# EAGLE schematic untitled (EAGLE 8.4.3)
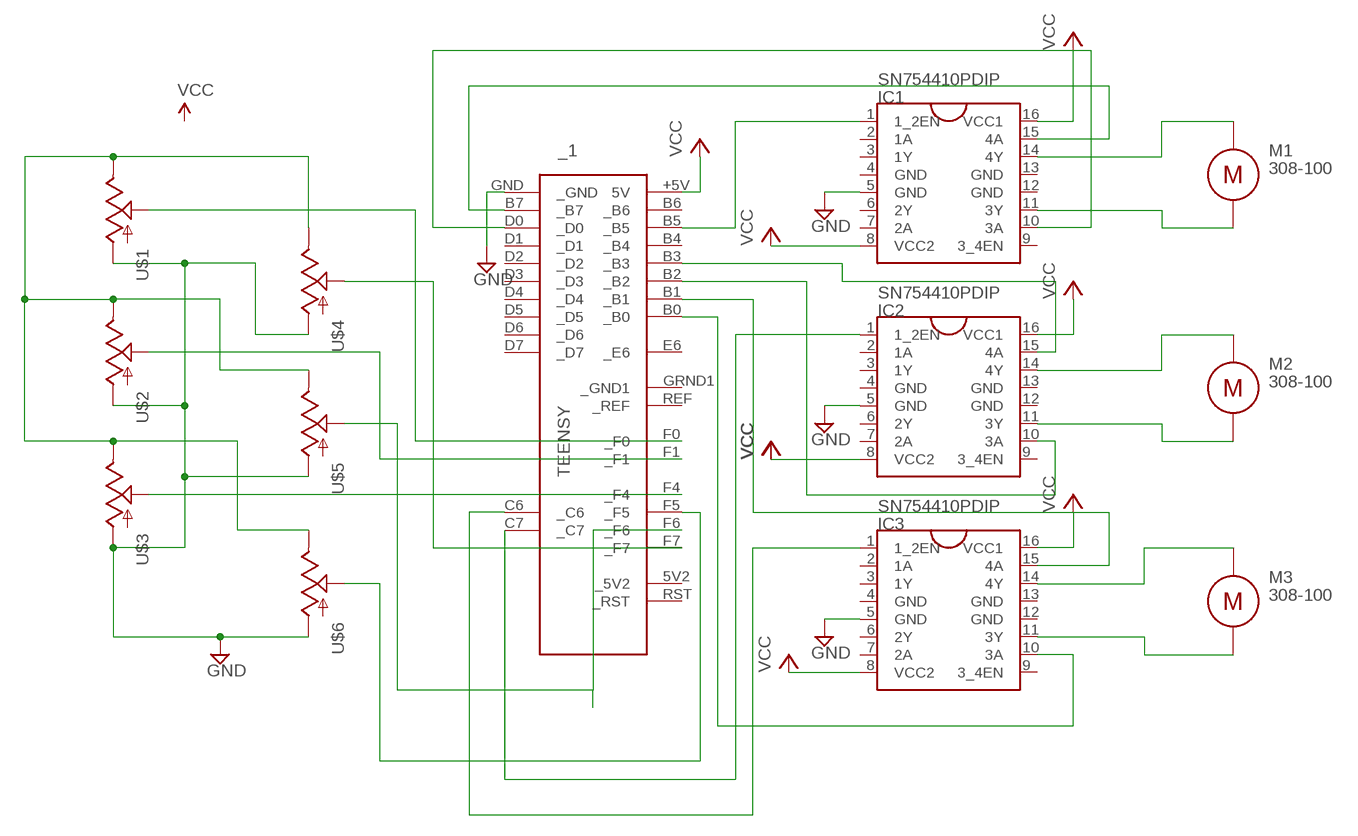
[diagram p0: schematic, sheet 1]

## Parts
_1  TEENSY  [TEENSY]
IC1  SN754410PDIP  [DIL16]
IC2  SN754410PDIP  [DIL16]
IC3  SN754410PDIP  [DIL16]
M1  308-100  [308-100]
M2  308-100  [308-100]
M3  308-100  [308-100]
U$1  POT  [ALPS_POT]
U$2  POT  [ALPS_POT]
U$3  POT  [ALPS_POT]
U$4  POT  [ALPS_POT]
U$5  POT  [ALPS_POT]
U$6  POT  [ALPS_POT]

## Nets
GND: _1.GND(_GND) IC1.5(GND) IC2.5(GND) IC3.5(GND) U$1.P$3(A) U$2.P$3(A) U$3.P$3(A) U$4.P$3(A) U$5.P$3(A) U$6.P$3(A)
N$1: IC1.14(4Y) M1.POS
N$2: IC1.11(3Y) M1.NEG
N$3: IC2.14(4Y) M2.POS
N$4: IC2.11(3Y) M2.NEG
N$5: IC3.14(4Y) M3.POS
N$6: IC3.11(3Y) M3.NEG
N$7: _1.B0(_B0) IC3.10(3A)
N$8: _1.B1(_B1) IC3.15(4A)
N$9: _1.B2(_B2) IC2.10(3A)
N$10: _1.B3(_B3) IC2.15(4A)
N$11: _1.B7(_B7) IC1.15(4A)
N$12: _1.D0(_D0) IC1.10(3A)
N$13: _1.B5(_B5) IC1.1(1_2EN)
N$14: _1.C6(_C6) IC3.1(1_2EN)
N$15: _1.C7(_C7) IC2.1(1_2EN)
N$16: U$1.P$1(E) U$2.P$1(E) U$3.P$1(E) U$4.P$1(E) U$5.P$1(E) U$6.P$1(E)
N$18: _1.F0(_F0) U$1.P$2(S)
N$19: _1.F1(_F1) U$2.P$2(S)
N$20: _1.F4(_F4) U$3.P$2(S)
N$21: _1.F5(_F5) U$6.P$2(S)
N$22: _1.F6(_F6) U$5.P$2(S)
N$23: _1.F7(_F7) U$4.P$2(S)
VCC: _1.+5V(5V) IC1.8(VCC2) IC1.16(VCC1) IC2.8(VCC2) IC2.16(VCC1) IC3.8(VCC2) IC3.16(VCC1)
Unconnected: _1.5V2(_5V2) _1.B4(_B4) _1.B6(_B6) _1.D1(_D1) _1.D2(_D2) _1.D3(_D3) _1.D4(_D4) _1.D5(_D5) _1.D6(_D6) _1.D7(_D7) _1.E6(_E6) _1.GRND1(_GND1) _1.REF(_REF) _1.RST(_RST) IC1.2(1A) IC1.3(1Y) IC1.4(GND) IC1.6(2Y) IC1.7(2A) IC1.9(3_4EN) IC1.12(GND) IC1.13(GND) IC2.2(1A) IC2.3(1Y) IC2.4(GND) IC2.6(2Y) IC2.7(2A) IC2.9(3_4EN) IC2.12(GND) IC2.13(GND) IC3.2(1A) IC3.3(1Y) IC3.4(GND) IC3.6(2Y) IC3.7(2A) IC3.9(3_4EN) IC3.12(GND) IC3.13(GND)

## Library data of the parts
_1 = teensy:TEENSY: Teensy 2.0
IC1-IC3 = AlexW-Eagle-Libraries:SN754410
M1-M3 = motor:308-100: Pico Vibe 8mm Vibration Motor - 3mm Type; PRECISION_MICRODRIVES: 308-100
U$1-U$6 = SparkFun-Electromechanical:POT